# Altium schematic sheet ESP12F.SchDoc
size A4
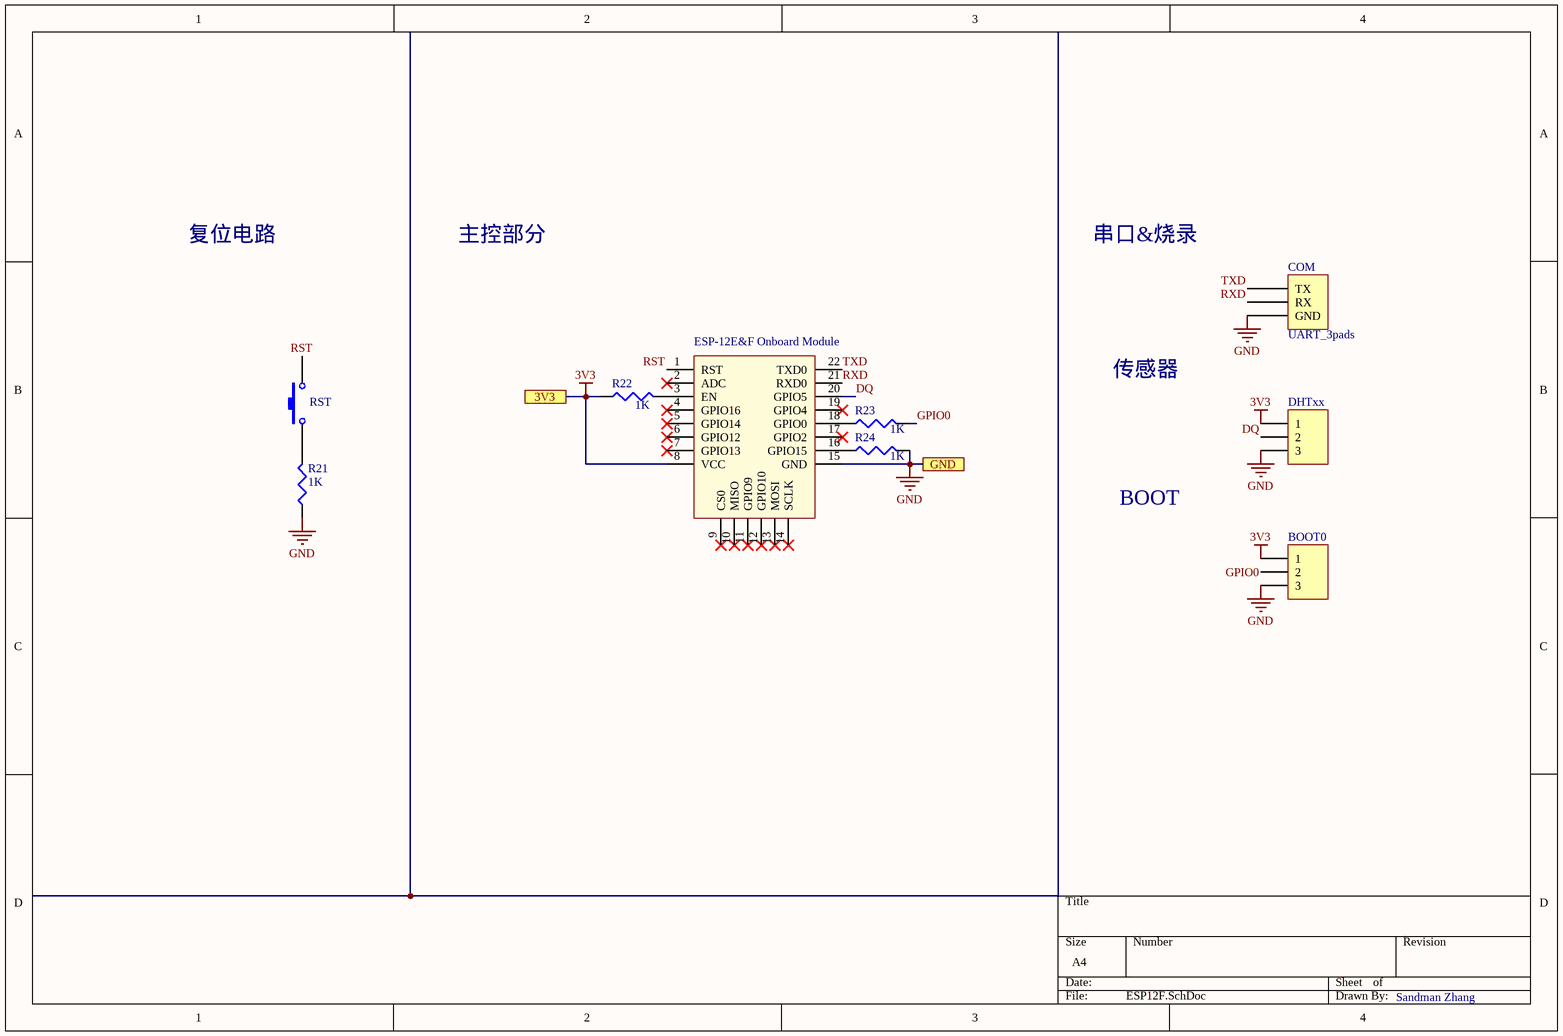
[diagram p0: ESP12F.SchDoc]

## Parts
BOOT0  工作  [HDR1X3]  (value not drawn)
COM  UART_3pads  [3pads]
DHTxx  7  [HDR1X3]  (value not drawn)
R21  value 1K  [J1-0603]  (hidden comment: Res3)
R22  value 1K  [J1-0603]  (hidden comment: Res3)
R23  value 1K  [J1-0603]  (hidden comment: Res3)
R24  value 1K  [J1-0603]  (hidden comment: Res3)
RST  SW-PB  [SPST-2]  (value not drawn)
U1  ESP-12E&F Onboard Module  [ESP-12E&F Module]

## Ports
3V3, GND

## Nets
3V3: BOOT0.1 DHTxx.1 R22.1 U1.8(VCC) ; port 3V3
GND: BOOT0.3 COM.2(GND) DHTxx.3 R21.1 R24.2 U1.15(GND) ; port GND
DQ: DHTxx.2 U1.20(GPIO5)
GPIO0: BOOT0.2 R23.2
RST: RST.2 U1.1(RST)
RXD: COM.1(RX) U1.21(RXD0)
TXD: COM.0(TX) U1.22(TXD0)
NetR21_2: R21.2 RST.1
NetR22_2: R22.2 U1.3(EN)
NetR23_1: R23.1 U1.18(GPIO0)
NetR24_1: R24.1 U1.16(GPIO15)

Not connected (* = marked no-connect by the designer): U1 2(ADC)* 4(GPIO16)* 5(GPIO14)* 6(GPIO12)* 7(GPIO13)* 9(CS0)* 10(MISO)* 11(GPIO9)* 12(GPIO10)* 13(MOSI)* 14(SCLK)* 17(GPIO2)* 19(GPIO4)*

## Notes on the sheet
- 复位电路
- 主控部分
- 串口&烧录
- 传感器
- BOOT
- Sandman Zhang

## Library data of the parts
BOOT0 DHTxx = Header 3: Header, 3-Pin; LatestRevisionDate: 17-Jul-2002; LatestRevisionNote: Re-released for DXP Platform.; Publisher: Altium Limited
R21-R24 = Res3: Resistor; Published: 8-Jun-2000; LatestRevisionDate: 29-May-2009; LatestRevisionNote: IPC-7351 Footprint Added.; PackageReference: J1-0603; Publisher: Altium Limited; PackageDescription: Chip Resistor
RST = SW-PB: Switch; Published: 24-Mar-1999; LatestRevisionDate: 17-Jul-2002; LatestRevisionNote: Re-released for DXP Platform.; PackageReference: SPST-2; Publisher: Altium Limited; PackageDescription: Switch; 2 Leads